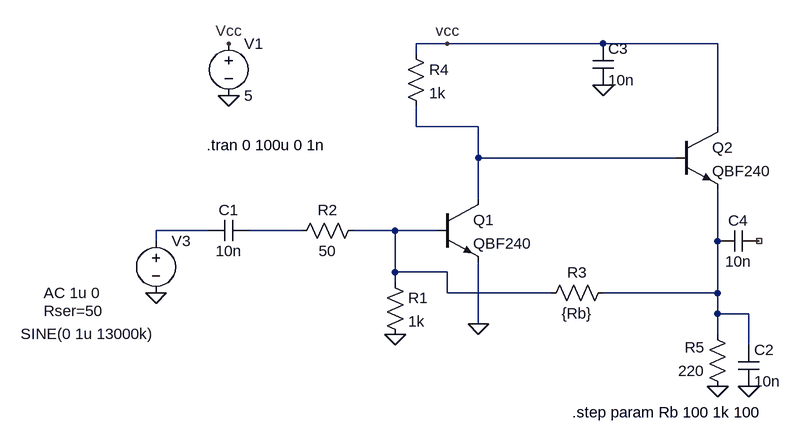
[diagram p0: schematic BF241 Wideband_AMP.asc]
BF241 Wideband_AMP.asc, the LTspice schematic file:
Version 4
SHEET 1 1068 680
WIRE 336 -144 288 -144
WIRE 576 -144 336 -144
WIRE 752 -144 576 -144
WIRE 288 -128 288 -144
WIRE 288 -16 288 -48
WIRE 384 -16 288 -16
WIRE 752 -16 752 -144
WIRE 384 32 384 -16
WIRE 688 32 384 32
WIRE 384 96 384 32
WIRE -32 144 -112 144
WIRE 112 144 32 144
WIRE 256 144 192 144
WIRE 320 144 256 144
WIRE -112 160 -112 144
WIRE 752 160 752 80
WIRE 256 208 256 144
WIRE 336 208 256 208
WIRE 256 224 256 208
WIRE 336 240 336 208
WIRE 496 240 336 240
WIRE 752 240 752 160
WIRE 752 240 576 240
WIRE 752 272 752 240
WIRE 800 272 752 272
WIRE 384 288 384 192
WIRE 752 304 752 272
WIRE 800 320 800 272
FLAG 0 -64 0
FLAG 0 -144 Vcc
FLAG -112 240 0
FLAG 336 -144 vcc
FLAG 752 384 0
FLAG 800 384 0
FLAG 256 304 0
FLAG 384 288 0
FLAG 576 -80 0
SYMBOL npn 320 96 R0
SYMATTR InstName Q1
SYMATTR Value QBF240
SYMBOL voltage 0 -160 R0
SYMATTR InstName V1
SYMATTR Value 5
SYMBOL cap 32 128 R90
WINDOW 0 0 32 VBottom 0
WINDOW 3 32 32 VTop 0
SYMATTR InstName C1
SYMATTR Value 10n
SYMBOL voltage -112 144 R0
WINDOW 3 -208 159 Left 0
WINDOW 123 -173 96 Left 0
WINDOW 39 -173 124 Left 0
SYMATTR InstName V3
SYMATTR Value SINE(0 1u 13000k)
SYMATTR Value2 AC 1u 0
SYMATTR SpiceLine Rser=50
SYMBOL res 768 400 R180
WINDOW 0 36 76 Left 0
WINDOW 3 36 40 Left 0
SYMATTR InstName R5
SYMATTR Value 220
SYMBOL cap 784 320 R0
SYMATTR InstName C2
SYMATTR Value 10n
SYMBOL res 272 -144 R0
SYMATTR InstName R4
SYMATTR Value 1k
SYMBOL npn 688 -16 R0
SYMATTR InstName Q2
SYMATTR Value QBF240
SYMBOL res 240 208 R0
SYMATTR InstName R1
SYMATTR Value 1k
SYMBOL res 208 128 R90
WINDOW 0 0 56 VBottom 0
WINDOW 3 32 56 VTop 0
SYMATTR InstName R2
SYMATTR Value 50
SYMBOL res 592 224 R90
WINDOW 0 0 56 VBottom 0
WINDOW 3 32 56 VTop 0
SYMATTR InstName R3
SYMATTR Value {Rb}
SYMBOL cap 560 -144 R0
SYMATTR InstName C3
SYMATTR Value 10n
SYMBOL cap 816 144 R90
WINDOW 0 0 32 VBottom 0
WINDOW 3 32 32 VTop 0
SYMATTR InstName C4
SYMATTR Value 10n
TEXT -34 12 Left 0 !.tran 0 100u 0 1n
TEXT 528 424 Left 0 !.step param Rb 100 1k 100

The netlist it stands for:
* BF241 Wideband_AMP.asc
Q1 N001 N004 0 0 QBF240
V1 Vcc 0 5
C1 N003 N002 10n
V3 N002 0 SINE(0 1u 13000k) AC 1u 0 Rser=50
R5 0 N005 220
C2 N005 0 10n
R4 Vcc N001 1k
Q2 Vcc N001 N005 0 QBF240
R1 N004 0 1k
R2 N004 N003 50
R3 N005 N004 {Rb}
C3 Vcc 0 10n
C4 NC_01 N005 10n
.model NPN NPN
.model PNP PNP
.lib standard.bjt
.tran 0 100u 0 1n
.step param Rb 100 1k 100
.backanno
.end